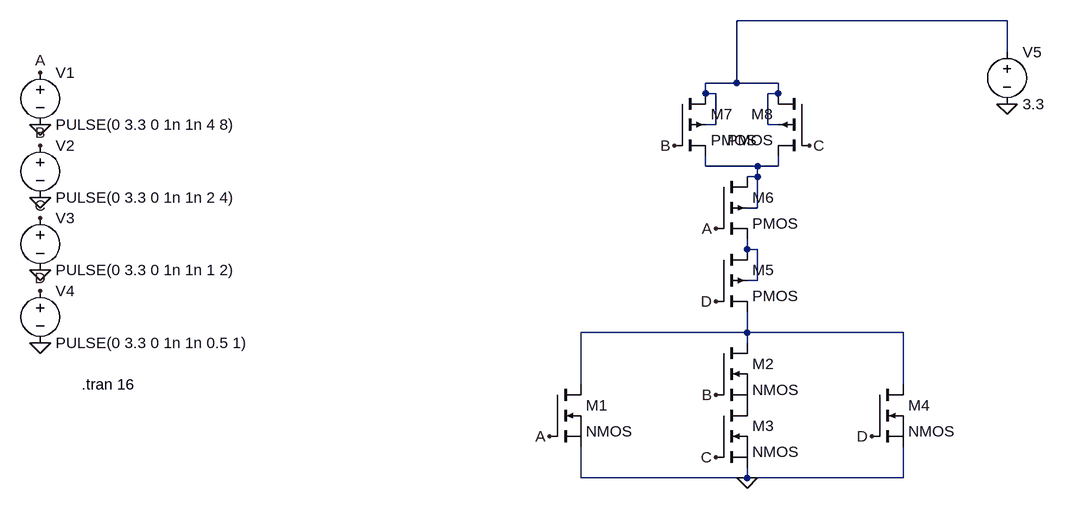
[diagram p0: schematic Draft1.asc]
Draft1.asc, the LTspice schematic file:
Version 4
SHEET 1 1456 680
WIRE 1392 -112 976 -112
WIRE 1392 -64 1392 -112
WIRE 976 -16 976 -112
WIRE 976 -16 928 -16
WIRE 1040 -16 976 -16
WIRE 928 0 928 -16
WIRE 944 0 928 0
WIRE 1040 0 1040 -16
WIRE 1040 0 1024 0
WIRE 944 48 944 0
WIRE 944 48 928 48
WIRE 1024 48 1024 0
WIRE 1040 48 1024 48
WIRE 928 112 928 96
WIRE 1008 112 928 112
WIRE 1040 112 1040 96
WIRE 1040 112 1008 112
WIRE 1008 128 1008 112
WIRE 1008 128 992 128
WIRE 1008 176 1008 128
WIRE 1008 176 992 176
WIRE 992 240 992 224
WIRE 1008 240 992 240
WIRE 1008 288 1008 240
WIRE 1008 288 992 288
WIRE 992 368 992 336
WIRE 992 368 736 368
WIRE 1232 368 992 368
WIRE 992 384 992 368
WIRE 736 448 736 368
WIRE 1232 448 1232 368
WIRE 736 592 736 544
WIRE 992 592 992 576
WIRE 992 592 736 592
WIRE 1232 592 1232 544
WIRE 1232 592 992 592
FLAG -96 48 0
FLAG -96 160 0
FLAG -96 272 0
FLAG -96 384 0
FLAG 1392 16 0
FLAG -96 -32 A
FLAG 688 528 A
FLAG 944 208 A
FLAG -96 80 B
FLAG 880 80 B
FLAG 944 464 B
FLAG -96 192 C
FLAG 1088 80 C
FLAG 944 560 C
FLAG -96 304 D
FLAG 944 320 D
FLAG 1184 528 D
FLAG 992 592 0
SYMBOL voltage -96 -48 R0
WINDOW 123 0 0 Left 0
WINDOW 39 0 0 Left 0
SYMATTR InstName V1
SYMATTR Value PULSE(0 3.3 0 1n 1n 4 8)
SYMBOL voltage -96 64 R0
SYMATTR InstName V2
SYMATTR Value PULSE(0 3.3 0 1n 1n 2 4)
SYMBOL voltage -96 176 R0
SYMATTR InstName V3
SYMATTR Value PULSE(0 3.3 0 1n 1n 1 2)
SYMBOL voltage -96 288 R0
SYMATTR InstName V4
SYMATTR Value PULSE(0 3.3 0 1n 1n 0.5 1)
SYMBOL nmos 688 448 R0
SYMATTR InstName M1
SYMBOL nmos 944 384 R0
SYMATTR InstName M2
SYMBOL nmos 944 480 R0
SYMATTR InstName M3
SYMBOL nmos 1184 448 R0
SYMATTR InstName M4
SYMBOL pmos4 944 240 R0
SYMATTR InstName M5
SYMBOL pmos4 944 128 R0
SYMATTR InstName M6
SYMBOL pmos4 880 0 R0
SYMATTR InstName M7
SYMBOL pmos4 1088 0 M0
SYMATTR InstName M8
SYMBOL voltage 1392 -80 R0
SYMATTR InstName V5
SYMATTR Value 3.3
TEXT -32 448 Left 2 !.tran 16

The netlist it stands for:
* Draft1.asc
V1 A 0 PULSE(0 3.3 0 1n 1n 4 8)
V2 B 0 PULSE(0 3.3 0 1n 1n 2 4)
V3 C 0 PULSE(0 3.3 0 1n 1n 1 2)
V4 D 0 PULSE(0 3.3 0 1n 1n 0.5 1)
M1 N004 A 0 0 NMOS
M2 N004 B P001 P001 NMOS
M3 P001 C 0 0 NMOS
M4 N004 D 0 0 NMOS
M5 N003 D N004 N003 PMOS
M6 N002 A N003 N002 PMOS
M7 N001 B N002 N001 PMOS
M8 N001 C N002 N001 PMOS
V5 N001 0 3.3
.model NMOS NMOS
.model PMOS PMOS
.lib standard.mos
.tran 16
.backanno
.end

* Results of the author's LTspice run, read from the files saved beside the schematic
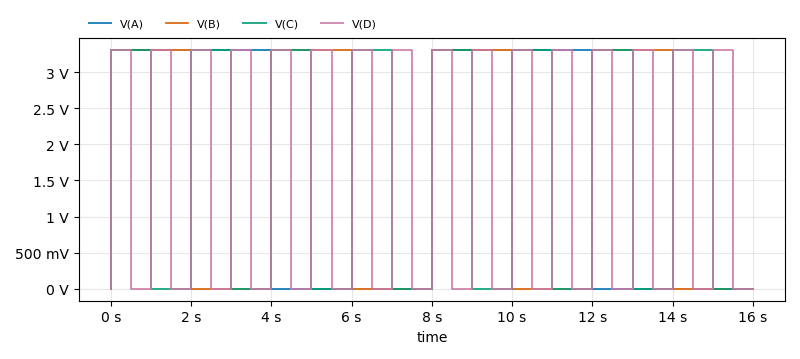
[diagram p1: Transient Analysis of Draft1.asc, plotted from the saved traces]
* Transient Analysis, 1 run:
*   V(A): min 0 V, max 3.3 V, average 1.65 V, rms 2.333 V, last 0 V
*   V(B): min 0 V, max 3.3 V, average 1.65 V, rms 2.333 V, last 0 V
*   V(C): min 0 V, max 3.3 V, average 1.65 V, rms 2.333 V, last 0 V
*   V(D): min 0 V, max 3.3 V, average 1.65 V, rms 2.333 V, last 0 V